# EAGLE design Thermocouple (EAGLE 9.6.2)
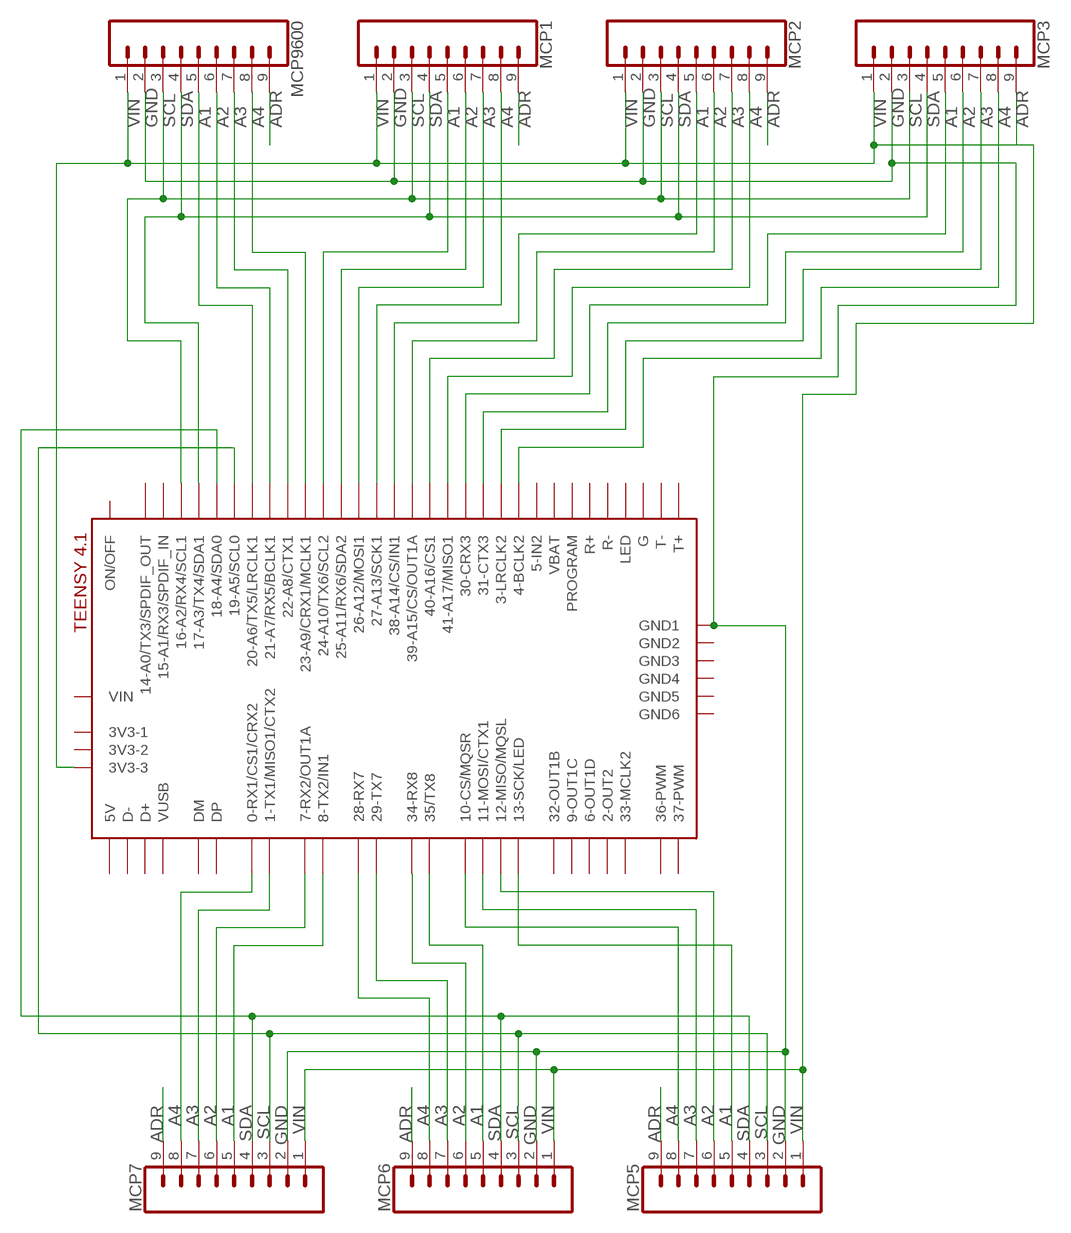
[diagram p0: schematic, sheet 1]

## Parts
MCP1  CONN_09  [1X09]
MCP2  CONN_09  [1X09]
MCP3  CONN_09  [1X09]
MCP5  CONN_09  [1X09]
MCP6  CONN_09  [1X09]
MCP7  CONN_09  [1X09]
MCP9600  CONN_09  [1X09]
U$1  TEENSY41  [TEENSY41]

## Nets
A1: MCP1.5 MCP2.5 MCP3.5 MCP9600.5 U$1.20-A6/TX5/LRCLK1 U$1.24-A10/TX6/SCL2 U$1.30-CRX3 U$1.38-A14/CS/IN1
A2: MCP1.6 MCP2.6 MCP3.6 MCP9600.6 U$1.21-A7/RX5/BCLK1 U$1.25-A11/RX6/SDA2 U$1.31-CTX3 U$1.39-A15/CS/OUT1A
A3: MCP1.7 MCP2.7 MCP3.7 MCP9600.7 U$1.3-LRCLK2 U$1.22-A8/CTX1 U$1.26-A12/MOSI1 U$1.40-A16/CS1
A4: MCP1.8 MCP2.8 MCP3.8 MCP9600.8 U$1.4-BCLK2 U$1.23-A9/CRX1/MCLK1 U$1.27-A13/SCK1 U$1.41-A17/MISO1
ADR: MCP1.9 MCP2.9 MCP3.9 MCP5.9 MCP6.9 MCP7.9 MCP9600.9
GND: MCP1.2 MCP2.2 MCP3.2 MCP5.2 MCP6.2 MCP7.2 MCP9600.2 U$1.GND1
N$1: MCP7.8 U$1.0-RX1/CS1/CRX2
N$2: MCP7.7 U$1.1-TX1/MISO1/CTX2
N$3: MCP7.6 U$1.7-RX2/OUT1A
N$4: MCP7.5 U$1.8-TX2/IN2(8-TX2/IN1)
N$5: MCP6.8 U$1.28-RX7
N$6: MCP6.7 U$1.29-TX7
N$7: MCP6.6 U$1.34-RX8
N$8: MCP6.5 U$1.35-TX8(35/TX8)
N$9: MCP5.8 U$1.10-CS\MQSR(10-CS/MQSR)
N$10: MCP5.7 U$1.11-MOSI/CTX1
N$11: MCP5.6 U$1.12-MISO/MQSL
N$12: MCP5.5 U$1.13-SCK/LED
SCL: MCP1.3 MCP2.3 MCP3.3 MCP5.3 MCP6.3 MCP7.3 MCP9600.3 U$1.16-A2/RX4/SCL1 U$1.19-A5/SCL0
SDA: MCP1.4 MCP2.4 MCP3.4 MCP5.4 MCP6.4 MCP7.4 MCP9600.4 U$1.17-A3/TX4/SDA1 U$1.18-A4/SDA0
VIN: MCP1.1 MCP2.1 MCP3.1 MCP5.1 MCP6.1 MCP7.1 MCP9600.1 U$1.3V3-3
Unconnected: U$1.2-OUT2 U$1.3V3-1 U$1.3V3-2 U$1.5-IN2 U$1.6-OUT1D U$1.9-OUT1C U$1.14-A0/TX3/SPDIF_OUT U$1.15-A1/RX3/SPDIF_IN U$1.32-OUT1B U$1.33-MCLK2 U$1.36-PWM U$1.37-PWM U$1.+5V(5V) U$1.D+ U$1.D- U$1.DM U$1.DP U$1.G U$1.GND2 U$1.GND3 U$1.GND4 U$1.GND5 U$1.GND6 U$1.LED U$1.ON/OFF U$1.PROGRAM U$1.R+ U$1.R- U$1.T+ U$1.T- U$1.VBAT U$1.VIN U$1.VUSB

## Library data of the parts
MCP1-MCP3 MCP5-MCP7 MCP9600 = SparkFun-Connectors:CONN_09: Multi connection point. Often used as Generic Header-pin footprint for 0.1 inch spaced/style header connections On any of the 0.1 inch spaced packages, you can populate with these: Break Away Headers - Straight <https://www.sparkfun.com/products/116> (PRT-00116) Break Away Male Headers - Right Angle <https://www.sparkfun.com/products/553> (PRT-00553) Female Headers <https://www.sparkfun.com/products/115> (PRT-00115) Break Away Headers - Machine Pin <https://www.sparkfun.com/products/117> (PRT-00117) Break Away Female Headers - Swiss Machine Pin <https://www.sparkfun.com/products/743> (PRT-00743) For SCREWTERMINALS and SPRING TERMINALS visit here: Screw Terimnals on SparkFun.com <https://www.sparkfun.com/search/results?term=Screw+Terminals> (5mm/3.5mm/2.54mm spacing) This device is also useful as a general connection point to wire up your design to another part of your project. Our various solder wires solder well into these plated through hole pads. Hook-Up Wire - Assortment (Stranded, 22 AWG) <https://www.sparkfun.com/products/11375> (PRT-11375) Hook-Up Wire - Assortment (Solid Core, 22 AWG) <https://www.sparkfun.com/products/11367> (PRT-11367) View the entire wire category on our website here <https://www.sparkfun.com/categories/141> Special notes: Molex polarized connector foot print use with SKU : PRT-08231 with associated crimp pins and housings. 1MM SMD Version SKU: PRT-10208 NOTES ON THE VARIANTS LOCK and LOCK_LONGPADS... This footprint was designed to help hold the alignment of a through-hole component (i.e. 6-pin header) while soldering it into place. You may notice that each hole has been shifted either up or down by 0.005 of an inch from it's more standard position (which is a perfectly straight line). This slight alteration caused the pins (the squares in the middle) to touch the edges of the holes. Because they are alternating, it causes a "brace" to hold the component in place. 0.005 has proven to be the perfect amount of "off-center" position when using our standard breakaway headers. Although looks a little odd when you look at the bare footprint, once you have a header in there, the alteration is very hard to notice. Also,if you push a header all the way into place, it is covered up entirely on the bottom side.; SPICEPREFIX: X
U$1 = teensy:TEENSY41

## Board
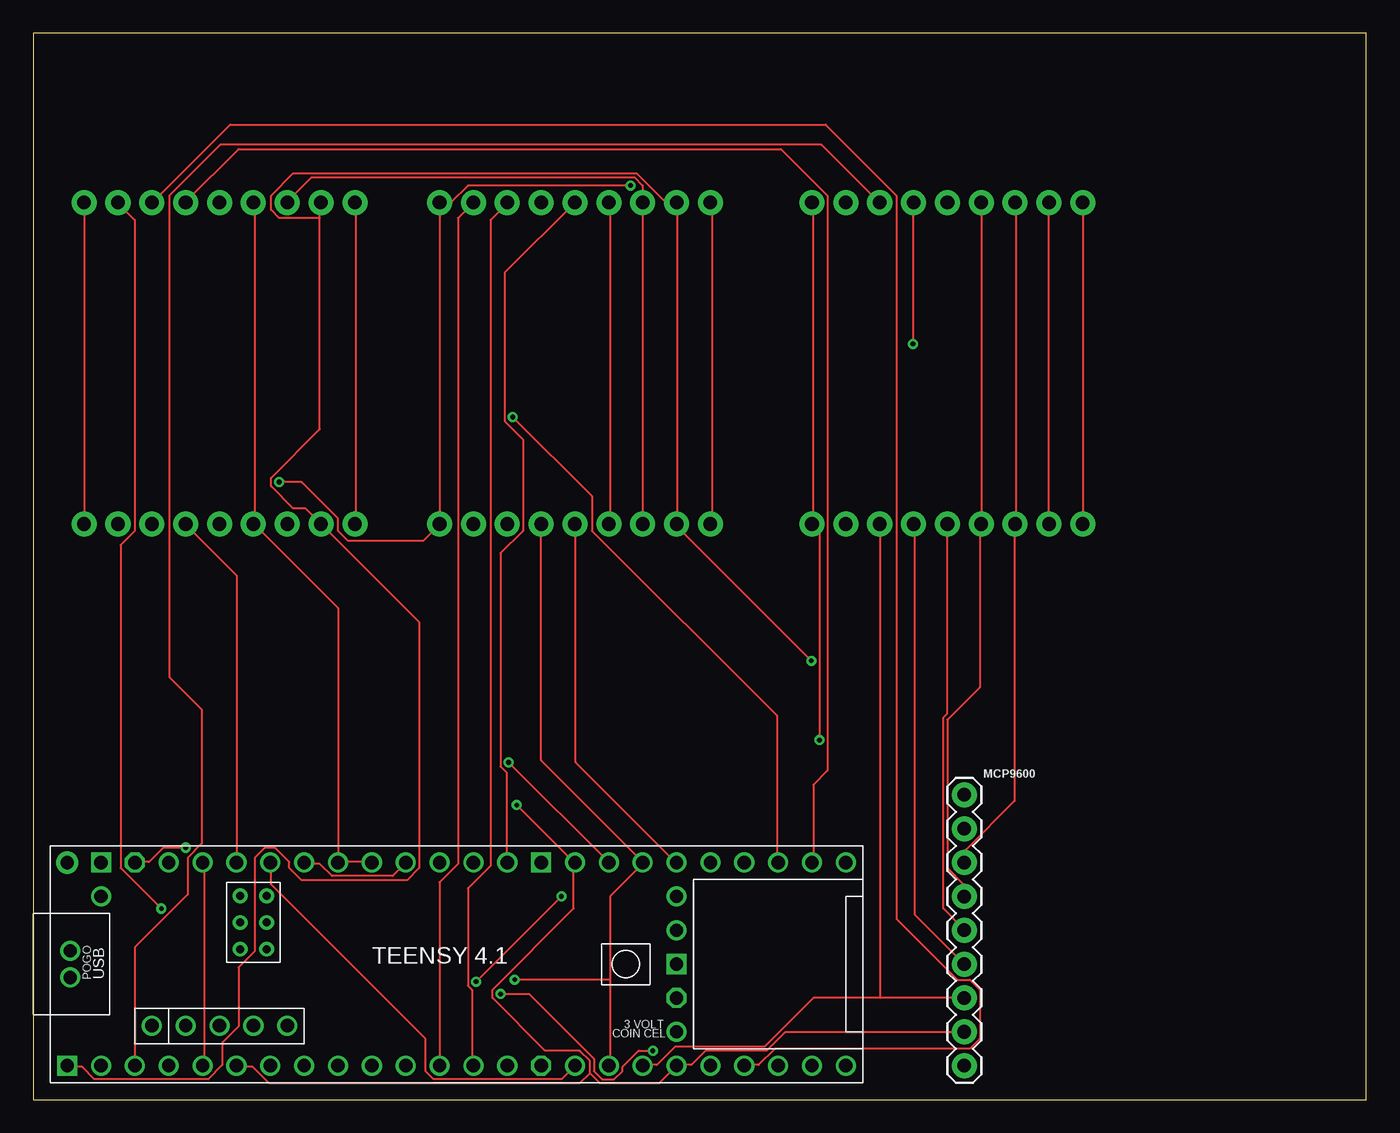
[diagram p1: board, top side]
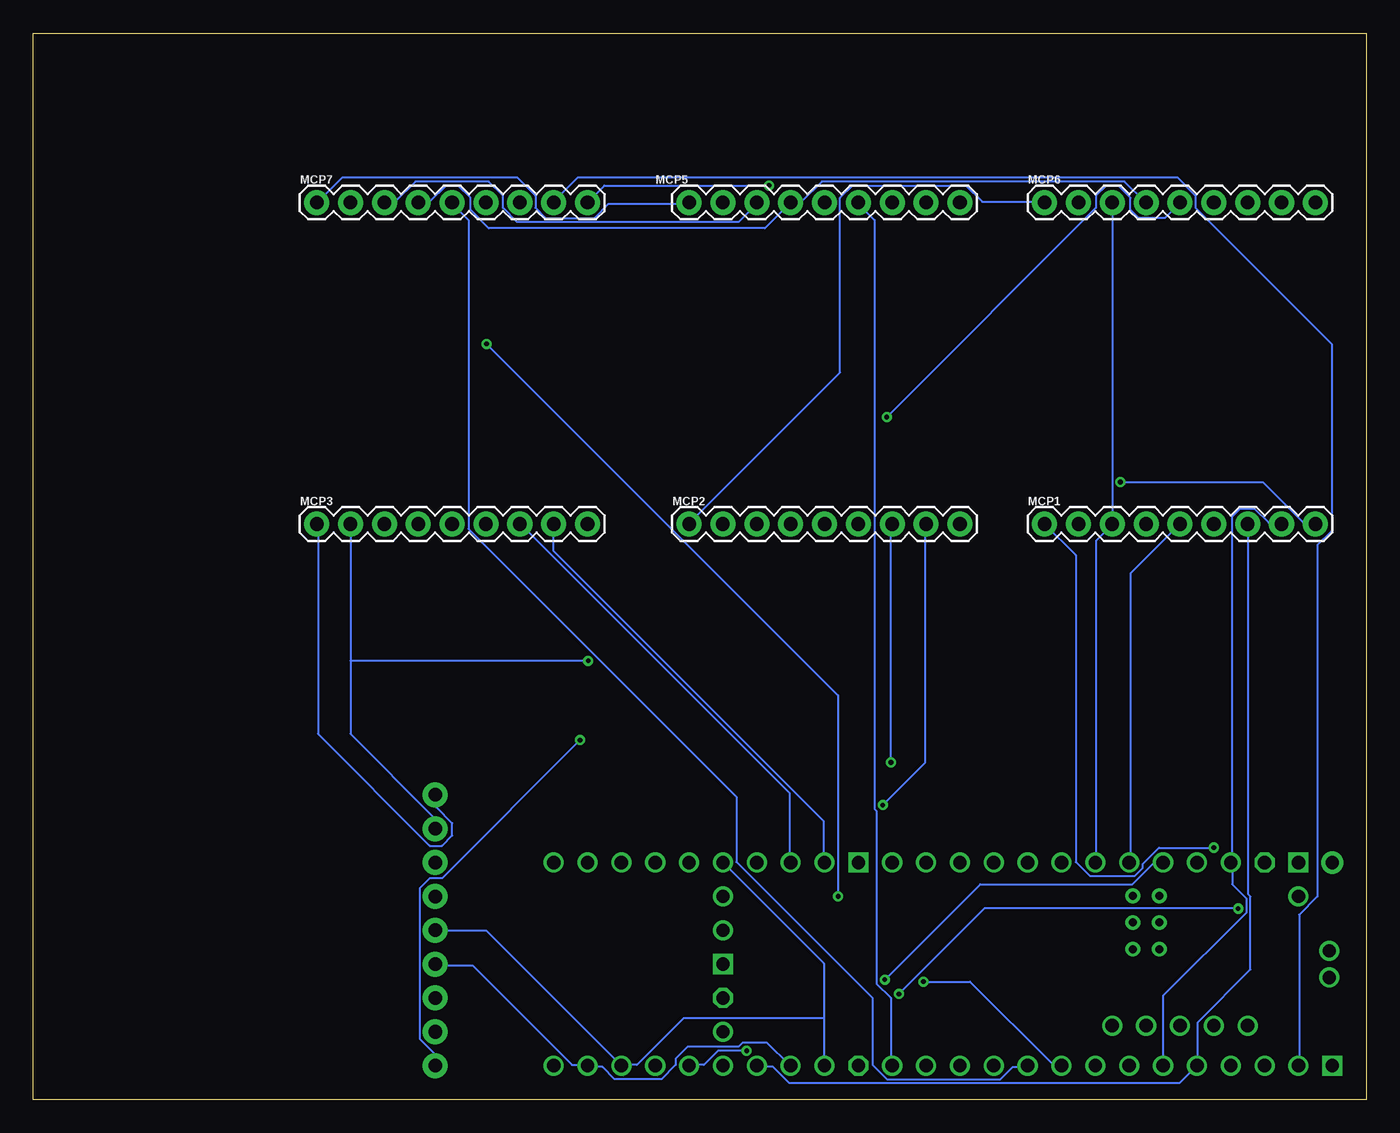
[diagram p2: board, bottom side, seen from below]

Size 100 x 80 mm. Coordinates in mm from the lower left corner, seen from the top.
Outline: 0,0 100,0 100,80 0,80 0,0
Copper layers (1*16): Top 0.035mm / dielectric 1.5mm / Bottom 0.035mm
Design rules "default": minimum track width 6mil, minimum drill 0.35mm, track to track 6mil, track to pad 6mil, pad to pad 6mil, via to via 6mil, smd to smd 6mil, copper to edge 40mil, drill to drill 6mil, minimum pad ring 10mil, minimum via ring 8mil, stop-mask expansion 4mil, vias tented up to drill 0mil, thermal gap 10mil

### Footprints (pad centres in the part's own frame; a part is rotated, then mirrored left to right if it is on the bottom)
1X09 = drill 1.016 pad 1.88: 1 0,0; 2 2.54,0; 3 5.08,0; 4 7.62,0; 5 10.16,0; 6 12.7,0; 7 15.24,0; 8 17.78,0; 9 20.32,0
TEENSY41 = drill 1: 0-RX1/CS1/CRX2 -27.94,-7.62; 1-TX1/MISO1/CTX2 -25.4,-7.62; 2-OUT2 -22.86,-7.62; 3-LRCLK2 -20.32,-7.62; 4-BCLK2 -17.78,-7.62; 5-IN2 -15.24,-7.62; 6-OUT1D -12.7,-7.62; 7-RX2/OUT1A -10.16,-7.62; 8-TX2/IN2 -7.62,-7.62; 9-OUT1C -5.08,-7.62; 10-CS\MQSR -2.54,-7.62; 11-MOSI/CTX1 0,-7.62; 12-MISO/MQSL 2.54,-7.62; 13-SCK/LED 2.54,7.62; 14-A0/TX3/SPDIF_OUT 0,7.62; 15-A1/RX3/SPDIF_IN -2.54,7.62; 16-A2/RX4/SCL1 -5.08,7.62; 17-A3/TX4/SDA1 -7.62,7.62; 18-A4/SDA0 -10.16,7.62; 19-A5/SCL0 -12.7,7.62; 20-A6/TX5/LRCLK1 -15.24,7.62; 21-A7/RX5/BCLK1 -17.78,7.62; 22-A8/CTX1 -20.32,7.62; 23-A9/CRX1/MCLK1 -22.86,7.62; 24-A10/TX6/SCL2 7.62,-7.62; 25-A11/RX6/SDA2 10.16,-7.62; 26-A12/MOSI1 12.7,-7.62; 27-A13/SCK1 15.24,-7.62; 28-RX7 17.78,-7.62; 29-TX7 20.32,-7.62; 30-CRX3 22.86,-7.62; 31-CTX3 25.4,-7.62; 32-OUT1B 27.94,-7.62; 33-MCLK2 27.94,7.62; 34-RX8 25.4,7.62; 35-TX8 22.86,7.62; 36-PWM 20.32,7.62; 37-PWM 17.78,7.62; 38-A14/CS/IN1 15.24,7.62; 39-A15/CS/OUT1A 12.7,7.62; 40-A16/CS1 10.16,7.62; 41-A17/MISO1 7.62,7.62; +5V -24.13,-4.62; D+ -30.25,-1; D- -30.25,1; DM -21.59,-4.62; DP -19.05,-4.62; GND4 -16.51,-4.62; GND5 -13.97,-4.62; ON/OFF 15.24,5.08; PROGRAM 15.24,2.54; VBAT 15.24,-5.08; VUSB -27.94,5.08 | drill 1 octagon: 3V3-1 5.08,-7.62; 3V3-2 15.24,-2.54; 3V3-3 -25.4,7.62 | drill 0.6: G -15.51,3.12; LED -17.51,3.12; R+ -17.51,5.12; R- -15.51,5.12; T+ -15.51,1.12; T- -17.51,1.12 | drill 1 square: GND1 -30.48,-7.62; GND2 15.24,0; GND3 5.08,7.62; GND6 -27.94,7.62 | drill 1 pad 1.676: VIN -30.48,7.62

### Placement (x,y rotation side)
MCP1  24.13,43.18 0 bottom
MCP2  50.8,43.18 0 bottom
MCP3  78.74,43.18 0 bottom
MCP5  50.8,67.31 0 bottom
MCP6  24.13,67.31 0 bottom
MCP7  78.74,67.31 0 bottom
MCP9600  69.85,22.86 270 top
U$1  33.02,10.16 0 top

### Tracks (layer width: path | path; a pad name or v marks a point on that pad's centre or on a via)
A1
  Top 0.152: MCP2.5 40.69,43.13 40.69,25.3 48.16,17.83 U$1.38-A14/CS/IN1 | MCP3.5 68.58,28.96 68.28,28.65 68.28,14.33 69.8,12.8 MCP9600.5 | U$1.24-A10/TX6/SCL2 39.62,1.52 30.02,1.52 29.41,2.13 29.41,4.57 17.83,16.15 17.83,17.68 U$1.20-A6/TX5/LRCLK1
  Bottom 0.152: MCP1.5 17.68,39.47 17.68,17.83 U$1.20-A6/TX5/LRCLK1 | 40.69,6.1 40.69,10.21 U$1.38-A14/CS/IN1 | 40.69,6.1 40.69,2.59 U$1.24-A10/TX6/SCL2 | 40.69,6.1 51.21,6.1 54.71,2.59 55.78,2.59 U$1.30-CRX3 65.99,12.65 69.8,12.65 MCP9600.5
A2  (via drill 0.35)
  Top 0.152: MCP9600.6 66.14,13.87 66.14,43.13 MCP3.6 | U$1.21-A7/RX5/BCLK1 15.24,39.32 11.43,43.13 MCP1.6 | 43.28,8.99 43.28,15.24 45.72,17.68 U$1.39-A15/CS/OUT1A 45.72,17.83 38.1,25.45 MCP2.6 | 43.28,8.99 43.28,2.59 U$1.25-A11/RX6/SDA2 | 43.28,8.99 v36.12,8.99
  Bottom 0.152: MCP9600.6 69.8,10.06 67.06,10.06 59.59,2.59 58.52,2.59 U$1.31-CTX3 58.37,2.44 57.3,2.44 56.39,1.52 52.88,1.52 51.82,2.59 51.82,3.05 50.9,3.96 47.09,3.96 46.79,4.27 44.96,4.27 43.28,2.59 U$1.25-A11/RX6/SDA2 | v36.12,8.99 28.96,16.15 17.53,16.15 16,17.68 15.24,17.68 U$1.21-A7/RX5/BCLK1
A3  (via drill 0.35)
  Top 0.152: U$1.40-A16/CS1 v35.66,25.3 | MCP9600.7 63.55,7.62 | 63.55,7.62 58.52,7.62 54.86,3.96 48.16,3.96 46.79,2.59 45.72,2.59 U$1.26-A12/MOSI1 | U$1.3-LRCLK2 12.8,2.59 12.8,17.68 U$1.22-A8/CTX1 | 63.55,7.62 63.55,43.13 MCP3.7
  Bottom 0.152: U$1.40-A16/CS1 43.28,17.83 43.28,23.01 63.4,43.13 MCP3.7 | v35.66,25.3 35.66,43.13 MCP2.7 | MCP1.7 8.84,43.13 8.84,15.39 8.69,15.24 8.69,9.75 12.65,5.79 12.65,2.59 U$1.3-LRCLK2 14.02,1.22 43.28,1.22 44.5,2.44 45.72,2.44 U$1.26-A12/MOSI1
A4  (via drill 0.35)
  Top 0.152: MCP9600.8 69.8,5.03 56.39,5.03 55.02,3.66 50.44,3.66 49.38,2.59 48.31,2.59 U$1.27-A13/SCK1 46.94,1.22 42.52,1.22 41.76,1.98 | 41.76,1.98 41.76,2.9 41,3.66 38.41,3.66 34.44,7.62 34.44,8.23 40.54,14.33 40.54,17.68 U$1.41-A17/MISO1 40.54,17.83 v36.27,22.1 | 41.76,1.98 41,1.22 17.68,1.22 16.46,2.44 15.24,2.44 U$1.4-BCLK2
  Bottom 0.152: U$1.4-BCLK2 15.24,7.77 8.99,14.02 8.99,15.09 10.06,16.15 10.06,17.68 U$1.23-A9/CRX1/MCLK1 10.06,17.83 10.06,43.74 9.45,44.35 8.38,44.35 7.32,43.28 6.4,43.28 MCP1.8 | v36.27,22.1 33.07,25.3 33.07,43.13 MCP2.8 | MCP3.8 60.96,41.15 40.69,20.88 40.69,17.83 U$1.41-A17/MISO1
ADR  (via drill 0.35)
  Top 0.152: MCP6.9 MCP1.9 | v18.44,46.33 20.12,46.33 22.86,43.59 22.86,42.67 23.62,41.91 29.26,41.91 30.48,43.13 MCP2.9 MCP5.9 30.48,67.36 31.39,67.36 32.61,68.58 v44.81,68.58 | v58.98,26.98 58.98,42.67 58.52,43.13 MCP3.9 58.52,43.28 58.52,67.21 MCP7.9
  Bottom 0.152: v18.44,46.33 7.77,46.33 4.72,43.28 3.81,43.28 MCP1.9 | v58.98,26.98 69.34,16.61 70.26,16.61 71.02,15.85 71.02,4.57 69.95,3.5 69.95,2.59 MCP9600.9 | v44.81,68.58 57.15,68.58 MCP7.9
GND  (via drill 0.35)
  Top 0.152: MCP3.2 MCP7.2 | U$1.GND1 2.59,2.44 3.66,2.44 4.57,1.52 13.11,1.52 14.17,2.59 14.17,4.27 15.39,5.49 15.39,9.91 16.61,11.12 16.61,18.14 17.37,18.9 18.14,18.9 19.2,17.83 19.2,17.37 20.12,16.46 28.04,16.46 28.96,17.37 28.96,35.81 MCP1.2 20.42,44.35 19.51,44.35 17.83,46.02 17.83,46.63 21.49,50.29 21.49,66.14 | 21.49,66.14 21.49,67.21 MCP6.2 | 21.49,66.14 18.44,66.14 17.83,66.75 17.83,67.82 19.51,69.49 45.26,69.49 47.4,67.36 48.16,67.36 MCP5.2 48.31,67.21 48.31,43.28 MCP2.2 48.16,43.13 v58.37,32.92
  Bottom 0.152: MCP3.2 76.2,32.92 | 76.2,32.92 76.2,27.43 69.95,21.18 69.95,20.42 MCP9600.2 | v58.37,32.92 76.2,32.92
N$1
  Bottom 0.152: U$1.0-RX1/CS1/CRX2 5.03,2.59 5.03,13.87 3.66,15.24 3.66,41.6 2.59,42.67 2.59,56.69 12.8,66.9 12.8,67.82 14.17,69.19 59.13,69.19 60.96,67.36 MCP7.8
N$2
  Top 0.152: U$1.1-TX1/MISO1/CTX2 7.62,11.43 11.58,15.39 11.58,18.14 12.65,19.2 12.65,29.26 10.21,31.7 10.21,67.82 14.02,71.63 59.13,71.63 63.4,67.36 MCP7.7
N$3  (via drill 0.35)
  Top 0.152: v39.62,15.24 v33.22,8.84 | v65.99,56.69 65.99,67.21 MCP7.6
  Bottom 0.152: v33.22,8.84 29.72,8.84 23.47,2.59 22.86,2.59 U$1.7-RX2/OUT1A | v39.62,15.24 39.62,30.33 v65.99,56.69
N$4
  Bottom 0.152: U$1.8-TX2/IN2 25.45,2.44 26.52,2.44 27.43,1.52 35.97,1.52 37.03,2.59 37.03,7.62 47.24,17.83 47.24,22.71 67.36,42.82 67.36,65.99 68.58,67.21 MCP7.5
N$5  (via drill 0.35)
  Top 0.152: v46.48,3.66 45.41,3.66 44.2,2.44 44.2,2.13 43.59,1.52 42.67,1.52 42.06,2.13 42.06,3.05 37.19,7.92 v35.05,7.92 | v9.6,14.33 6.55,17.37 6.55,41.6 7.62,42.67 7.62,65.99 6.4,67.21 MCP6.8
  Bottom 0.152: v46.48,3.66 48.62,3.66 49.68,2.59 50.75,2.59 U$1.28-RX7 | v35.05,7.92 28.65,14.33 v9.6,14.33
N$6
  Top 0.152: U$1.29-TX7 53.34,2.59 54.41,2.59 55.63,3.81 70.26,3.81 71.02,4.57 71.02,8.23 70.26,8.99 69.34,8.99 64.77,13.56 64.77,67.82 59.44,73.15 14.78,73.15 8.99,67.36 MCP6.7
N$7
  Top 0.152: U$1.34-RX8 58.52,17.83 58.52,23.62 59.59,24.69 59.59,67.82 56.08,71.32 15.39,71.32 11.43,67.36 MCP6.6
N$8  (via drill 0.35)
  Top 0.152: v35.97,51.21 41.91,45.26 41.91,42.67 55.78,28.8 55.78,17.83 U$1.35-TX8
  Bottom 0.152: v35.97,51.21 20.27,66.9 20.27,67.82 19.51,68.58 18.59,68.58 17.68,67.67 17.68,66.75 17.07,66.14 15.09,66.14 14.02,67.21 MCP6.5
N$9
  Top 0.152: U$1.10-CS\MQSR 30.48,16.31 31.85,17.68 31.85,66.14 MCP5.8
N$10
  Top 0.152: U$1.11-MOSI/CTX1 32.92,2.59 32.92,8.23 32.61,8.53 32.61,15.85 34.29,17.53 34.29,65.99 35.51,67.21 MCP5.7
N$11
  Bottom 0.152: U$1.12-MISO/MQSL 35.66,2.59 35.66,7.62 36.73,8.69 36.73,21.64 36.88,21.79 36.88,65.99 38.1,67.21 MCP5.6
N$12
  Top 0.152: MCP5.5 35.36,62.03 35.36,50.9 36.73,49.53 36.73,42.67 35.05,41 35.05,24.99 35.51,24.54 35.51,17.83 U$1.13-SCK/LED
SCL
  Top 0.152: MCP9600.3 69.95,17.83 69.95,18.75 73.61,22.4 73.61,43.13 MCP3.3 73.76,43.28 73.76,67.21 MCP7.3 | MCP2.3 MCP5.3 45.72,68.58 45.11,69.19 20.88,69.19 19.05,67.36 MCP6.3 | U$1.19-A5/SCL0 20.42,17.68 21.49,17.68 22.4,16.76 26.98,16.76 27.89,17.68 U$1.16-A2/RX4/SCL1
  Bottom 0.152: MCP6.3 MCP1.3 19.05,43.13 20.27,41.91 20.27,17.83 U$1.19-A5/SCL0 | MCP7.3 73.61,67.36 72.85,67.36 71.32,68.89 65.84,68.89 64.77,67.82 64.77,66.9 63.7,65.84 47.09,65.84 45.72,67.21 MCP5.3
SDA
  Top 0.152: MCP9600.4 69.8,15.24 69.8,16.15 68.58,17.37 68.58,28.5 71.02,30.94 71.02,43.13 MCP3.4 71.17,43.28 71.17,67.21 MCP7.4 | MCP2.4 43.28,43.28 43.28,67.21 MCP5.4 | 22.86,17.83 25.3,17.83 U$1.17-A3/TX4/SDA1 | MCP6.4 16.61,67.21 16.61,43.28 MCP1.4 16.61,43.13 22.86,36.88 22.86,17.83 | 22.86,17.83 U$1.18-A4/SDA0
  Bottom 0.152: MCP6.4 16.61,67.36 18.14,68.89 40.84,68.89 42.37,67.36 43.13,67.36 MCP5.4 45.11,65.38 65.84,65.38 67.21,66.75 67.21,67.67 68.12,68.58 69.04,68.58 70.26,67.36 71.02,67.36 MCP7.4
VIN  (via drill 0.35)
  Top 0.152: v11.43,18.9 9.75,18.9 8.69,17.83 7.62,17.83 U$1.3V3-3 | MCP6.1 24.23,67.21 24.23,43.28 MCP1.1 | MCP2.1 50.9,43.28 50.9,67.21 MCP5.1 | MCP7.1 78.79,67.21 78.79,43.28 MCP3.1
  Bottom 0.152: v11.43,18.9 15.54,18.9 16.76,17.68 16.76,17.37 17.37,16.76 20.73,16.76 21.79,17.83 21.79,40.84 MCP1.1 | MCP9600.1 69.8,22.86 69.8,21.95 68.58,20.73 68.58,19.81 69.34,19.05 70.26,19.05 78.64,27.43 78.64,43.13 MCP3.1 | MCP5.1 50.9,67.21 56.84,67.21 57.91,66.14 61.57,66.14 62.33,66.9 62.33,67.82 63.7,69.19 76.81,69.19 78.64,67.36 MCP7.1 | MCP6.1 24.23,67.36 28.8,67.36 30.02,68.58 38.56,68.58 39.47,67.67 39.47,54.56 50.75,43.28 MCP2.1